# Altium project Gateway.PrjPcb
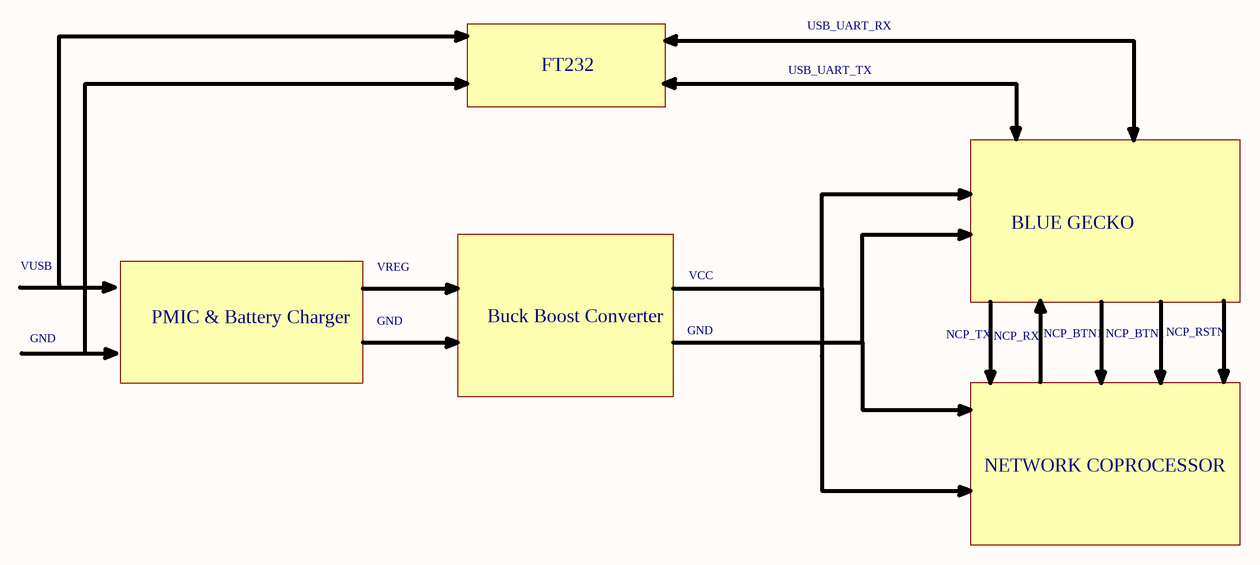
[diagram p0: BlockDiagram.SchDoc]
6 sheets, 93 parts. Net scope: global (net labels, ports and power ports of the same name join across sheets).
Board file: Gateway.PcbDoc
Sheets:
  BlockDiagram.SchDoc
  PMIC.SchDoc
  Regulator.SchDoc
  Gecko.SchDoc
  Gecko_IO.SchDoc
  UART_USB.SchDoc

## Sheet BlockDiagram.SchDoc: Block Diagram
size A4; Organization: Gateway; Address1: University of Colorado; Address2: Boulder; DocumentNumber: 1; Revision: 1; SheetNumber: 1; SheetTotal: 6

### Notes on the sheet
- USB_UART_RX
- FT232
- USB_UART_TX
- BLUE GECKO
- VUSB
- PMIC & Battery Charger
- VREG
- GND
- Buck Boost Converter
- VCC
- NCP_TX
- NCP_RX
- NCP_BTN1
- NCP_RSTN
- NETWORK COPROCESSOR
- Title
- Size:
- Date:
- A4
- Number:
- Time:
- Revision:
- Sheet
- of
- File:

## Sheet PMIC.SchDoc: PMIC
size A4; Organization: Gateway; Address1: University of Colorado; Address2: Boulder; DocumentNumber: 2; Revision: 1; SheetNumber: 2; SheetTotal: 6
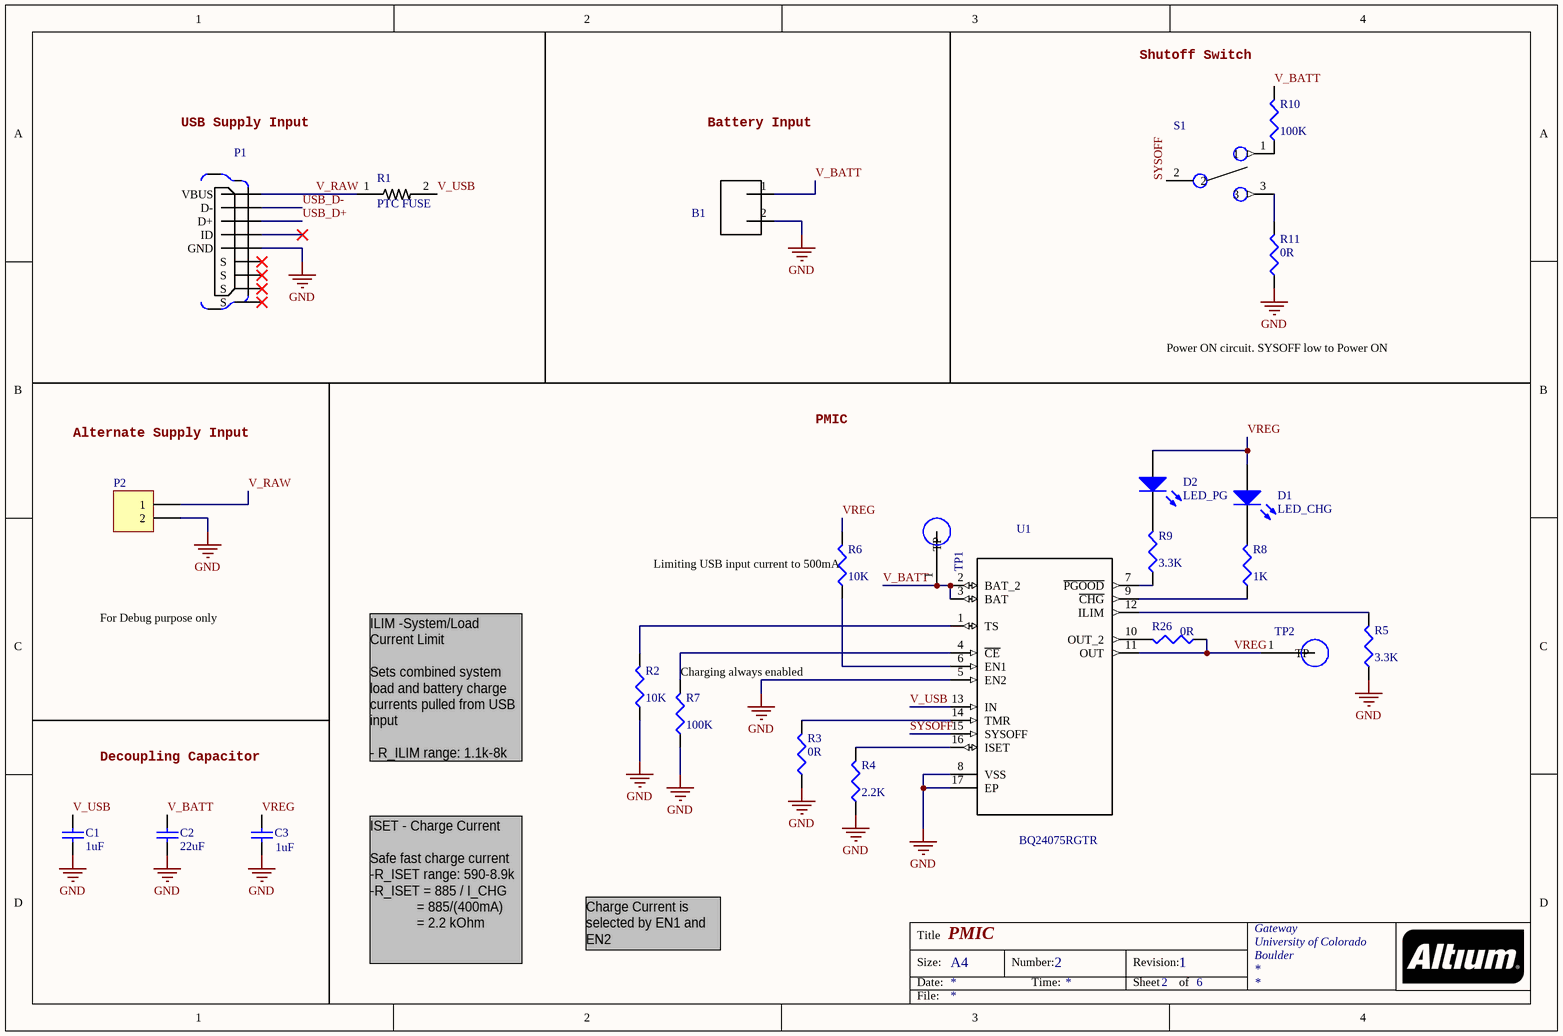
[diagram p1: PMIC.SchDoc]

### Parts
B1  VBATT  [S2B-PH-SM4-TB(LF)(SN)]  (value not drawn)
C1  value 1uF  [1608[0603]]  (hidden comment: CL10B105KP8NNNC)
C2  value 22uF  [1608[0603]]  (hidden comment: CL10A226MPCNUBE)
C3  value 1uF  [1608[0603]]  (hidden comment: CL10B105KP8NNNC)
D1  LED_CHG  [1608[0603]]
D2  LED_PG  [1608[0603]]
P1  10104111-0001LF  [FRAMATOME_10104111-0001LF]  (value not drawn)
P2  (no value)  [HDR1X2]
R1  PTC FUSE  [RESC3216X125N]
R2  value 10K  [1608[0603]]  (hidden comment: MCT06030C1002FP500)
R3  value 0R  [1608[0603]]  (hidden comment: MCT0603MZ0000ZP500)
R4  value 2.2K  [1608[0603]]  (hidden comment: ERJ-3EKF2201V)
R5  value 3.3K  [1608[0603]]  (hidden comment: ERJ-3GEYJ332V)
R6  value 10K  [1608[0603]]  (hidden comment: MCT06030C1002FP500)
R7  value 100K  [1608[0603]]  (hidden comment: RG1608P-104-B-T5)
R8  value 1K  [1608[0603]]  (hidden comment: MCT06030C1001FP500)
R9  value 3.3K  [1608[0603]]  (hidden comment: ERJ-3GEYJ332V)
R10  value 100K  [1608[0603]]  (hidden comment: RG1608P-104-B-T5)
R11  value 0R  [1608[0603]]  (hidden comment: MCT0603MZ0000ZP500)
R26  value 0R  [1608[0603]]  (hidden comment: MCT0603MZ0000ZP500)
S1  AYZ0102AGRLC  [SW_AYZ0102AGRLC]  (value not drawn)
TP1  VBATT_TP  [TP380X203]  (value not drawn)
TP2  VREG_TP  [TP380X203]  (value not drawn)
U1  BQ24075RGTR  [QFN50P300X300X100-17N]

### Nets
GND: B1.2 C1.1 C2.2 C3.1 P1.5(GND) P2.2 R2.1 R3.1 R4.1 R5.1 R7.1 R11.1 U1.5(EN2) U1.8(VSS) U1.17(EP)
SYSOFF: S1.2 U1.15(SYSOFF)
USB_D+: P1.3(D+)
USB_D-: P1.2(D-)
V_BATT: B1.1 C2.1 R10.2 TP1.1(TP) U1.2(BAT_2) U1.3(BAT)
V_RAW: P1.1(VBUS) P2.1 R1.1
V_USB: C1.2 R1.2 U1.13(IN)
VREG: C3.2 D1.1(A) D2.1(A) R6.2 R26.1 TP2.1(TP) U1.11(OUT)
NetD1_2: D1.2(K) R8.2
NetD2_2: D2.2(K) R9.2
NetR2_2: R2.2 U1.1(TS)
NetR3_2: R3.2 U1.14(TMR)
NetR4_2: R4.2 U1.16(ISET)
NetR5_2: R5.2 U1.12(ILIM)
NetR6_1: R6.1 U1.6(EN1)
NetR7_2: R7.2 U1.4(~{CE})
NetR8_1: R8.1 U1.9(~{CHG})
NetR9_1: R9.1 U1.7(~{PGOOD})
NetR10_1: R10.1 S1.1
NetR11_2: R11.2 S1.3
NetR26_2: R26.2 U1.10(OUT_2)

Not connected (* = marked no-connect by the designer): P1 4(ID)* 6(S)* 7(S)* 8(S)* 9(S)*

### Notes on the sheet
- Shutoff Switch
- USB Supply Input
- Battery Input
- Power ON circuit. SYSOFF low to Power ON
- Alternate Supply Input
- PMIC
- (near R6) Limiting USB input current to 500mA
- For Debug purpose only
- (near R7) Charging always enabled
- Decoupling Capacitor
- ILIM -System/Load Current Limit
  Sets combined system load and battery charge currents pulled from USB input
  - R_ILIM range: 1.1k-8k
  - R_ILIM= 1650 / I_INMAX
  = 1650 / 0.5
  = 3.3 kOhm
- ISET - Charge Current
  Safe fast charge current
  -R_ISET range: 590-8.9k
  -R_ISET = 885 / I_CHG
  = 885/(400mA)
  = 2.2 kOhm
- Charge Current is selected by EN1 and EN2
- Title
- Size:
- Date:
- A4
- Number:
- Time:
- Revision:
- Sheet
- of
- File:

### Library data of the parts
B1 = S2B-PH-SM4-TB(LF)(SN): CONN HEADER PH SIDE 2POS 2MM SMD; Manufacturer: JST Sales America Inc.; Digi-Key Part Number: 455-1749-1-ND; Manufacturer Part Number: S2B-PH-SM4-TB(LF)(SN); ComponentLink1URL: https://www.digikey.com/products/en/connectors-interconnects/rectangular-connectors-headers-male-pins/314?k=S2B-PH-SM4-TB%28LF%29%28SN%29&k=&pkeyword=S2B-PH-SM4-TB%28LF%29%28SN%29&pv7=2&sf=0&quantity=&ColumnSort=0&page=1&pageSize=25; ComponentLink1Description: Digi-Key URL
C1 C3 = Cap Semi: CAP CER 1UF 10V X7R 0603; Manufacturer: Samsung Electro-Mechanics; Digi-Key Part Number: 1276-1946-1-ND; Manufacturer Part Number: CL10B105KP8NNNC; ComponentLink1URL: https://www.digikey.com/product-detail/en/samsung-electro-mechanics/CL10B105KP8NNNC/1276-1946-1-ND/3890032; ComponentLink1Description: Digi-Key Link
C2 = Cap: CAP CER 22UF 10V X5R 0603; Manufacturer: Samsung Electro-Mechanics; Published: 8-Jun-2000; LatestRevisionDate: 17-Jul-2002; LatestRevisionNote: Re-released for DXP Platform.; PackageReference: RAD-0.3; Publisher: Altium Limited; PackageDescription: Radial Cap, Thru-Hole; 2 Leads; 0.3 in Pin Spacing; Manufacturer Part Number: CL10A226MPCNUBE; Digi-Key Part Number: 1276-6504-1-ND; ComponentLink1URL: https://www.digikey.com/product-detail/en/samsung-electro-mechanics/CL10A226MPCNUBE/1276-6504-1-ND/5961363; ComponentLink1Description: Digi-Key Link
D1 = LED2: Blue 470nm LED Indication - Discrete 2.85V 0603 (1608 Metric); Manufacturer: OSRAM Opto Semiconductors Inc.; Manufacturer Part Number: LB Q39G-L2OO-35-1; Digi-Key Part Number: 475-2816-1-ND; ComponentLink1URL: https://www.digikey.com/product-detail/en/osram-opto-semiconductors-inc/LB-Q39G-L2OO-35-1/475-2816-1-ND/2176355; ComponentLink1Description: Digi-Key Link
D2 = LED2: LED GREEN DIFFUSED 0603 SMD; Manufacturer: OSRAM Opto Semiconductors Inc.; Manufacturer Part Number: LG L29K-F2J1-24-Z; Digi-Key Part Number: 475-3118-1-ND; ComponentLink1URL: https://www.digikey.com/product-detail/en/osram-opto-semiconductors-inc/LG-L29K-F2J1-24-Z/475-3118-1-ND/4899549; ComponentLink1Description: Digi-Key Link
P1 = 10104111-0001LF: Micro Usb, 2.0 Type Ab, Receptacle, Th; Manufacturer: Amphenol FCI; Digi-Key Part Number: 609-4053-1-ND; ComponentLink1URL: https://www.digikey.com/product-detail/en/amphenol-fci/10104111-0001LF/609-4053-1-ND/2350359?utm_source=snapeda&utm_medium=aggregator&utm_campaign=symbol; Manufacturer Part Number: 10104111-0001LF; Value: *; ComponentLink1Description: Digi-Key Link
P2 = Header 2: Header, 2-Pin
R1 = 0ZCA0075FF2G: PTC RESET FUSE 6V 500MA 1206; Manufacturer: Bel Fuse; Manufacturer Part Number: Littelfuse Inc.; Package: 1206 Bel Fuse; Availability: Available; MP: 0ZCA0075FF2G; Price: None; SnapEDA_Link: https://www.snapeda.com/parts/0ZCA0075FF2G/Bel%20Fuse%20Inc./view-part/?ref=snap; Value: *; ComponentLink1URL: https://www.digikey.com/product-detail/en/littelfuse-inc/1206L050YR/F2112CT-ND/455721; ComponentLink1Description: Digi-Key Link; Digi-Key Part Number: F2112CT-ND
R2 R6 = Res3: RES SMD 10K OHM 1% 1/8W 0603; Manufacturer: Vishay Beyschlag; Digi-Key Part Number: MCT0603-10.0K-CFCT-ND; ComponentLink1URL: https://www.digikey.com/products/en?keywords=MCT0603-10.0K-CFCT-ND; ComponentLink1Description: Digi-Key URL; Manufacturer Part Number: MCT06030C1002FP500
R3 R11 R26 = Res3: RES 0 OHM JUMPER 1/8W 0603; Manufacturer: Vishay Beyschlag; Published: 8-Jun-2000; LatestRevisionDate: 29-May-2009; LatestRevisionNote: IPC-7351 Footprint Added.; PackageReference: J1-0603; Publisher: Altium Limited; PackageDescription: Chip Resistor; Digi-Key Part Number: 749-1745-1-ND; Manufacturer Part Number: MCT0603MZ0000ZP500; ComponentLink1URL: https://www.digikey.com/product-detail/en/vishay-beyschlag/MCT0603MZ0000ZP500/749-1745-1-ND/7348053
  R3 R26: ComponentLink1Description: Digi-Key Link
  R11: ComponentLink2Description: Digi-Key Link
R4 = Res3: RES SMD 2.2K OHM 1% 1/10W 0603; Manufacturer: Panasonic Electronic Components; Digi-Key Part Number: P2.20KHCT-ND; ComponentLink1URL: https://www.digikey.com/product-detail/en/panasonic-electronic-components/ERJ-3EKF2201V/P2.20KHCT-ND/1746742; ComponentLink1Description: Digi-Key URL; Manufacturer Part Number: ERJ-3EKF2201V
R5 R9 = Res3: RES SMD 3.3K OHM 5% 1/10W 0603; Manufacturer: Panasonic Electronic Components; Digi-Key Part Number: P3.3KGCT-ND; ComponentLink1URL: https://www.digikey.com/product-detail/en/panasonic-electronic-components/ERJ-3GEYJ332V/P3.3KGCT-ND/135146; ComponentLink1Description: Digi-Key URL; Manufacturer Part Number: ERJ-3GEYJ332V
R7 R10 = Res3: RES SMD 100K OHM 0.1% 1/10W 0603; Manufacturer: Susumu; Digi-Key Part Number: RG16P100KBCT-ND; ComponentLink1URL: https://www.digikey.com/products/en?keywords=RG16p100kbct-nd; ComponentLink1Description: Digi-Key URL; Manufacturer Part Number: RG1608P-104-B-T5
R8 = Res3: RES SMD 1K OHM 1% 1/8W 0603; Manufacturer: Vishay Beyschlag; Digi-Key Part Number: MCT0603-1.00K-CFCT-ND; ComponentLink1URL: https://www.digikey.com/product-detail/en/vishay-beyschlag/MCT06030C1001FP500/MCT0603-1.00K-CFCT-ND/2607875; ComponentLink1Description: Digi-Key URL; Manufacturer Part Number: MCT06030C1001FP500
S1 = AYZ0102AGRLC: SWITCH SLIDE SPDT 100MA 12V; Manufacturer: C&K; Digi-Key Part Number: 401-2012-1-ND; Manufacturer Part Number: AYZ0102AGRLC; ComponentLink1URL: https://www.digikey.com/products/en/switches/slide-switches/213?k=AYZ0102AGRLC&k=&pkeyword=AYZ0102AGRLC&pv7=2&sf=0&quantity=&ColumnSort=0&page=1&pageSize=25; ComponentLink1Description: Digi-Key Link
TP1 TP2 = 5019: PC TEST POINT MINIATURE; Manufacturer: Keystone Electronics; MF: Keystone; MP: 5019; Package: 2010 Keystone; Digi-Key_Part_Number: 36-5019CT-ND; ComponentLink1URL: https://www.digikey.com/product-detail/en/keystone-electronics/5019/36-5019CT-ND/3907344?utm_source=snapeda&utm_medium=aggregator&utm_campaign=symbol; SnapEDA_Link: https://www.snapeda.com/parts/5019/Keystone%20Electronics/view-part/?ref=snap; Value: *; ComponentLink1Description: Digi-Key Link; Manufacturer Part Number: 5019; Digi-Key Part Number: 36-5019CT-ND
U1 = BQ24075RGTT: IC LI-ION CHARGE MGMT 16-QFN; Manufacturer: Texas Instruments; SnapEDA_Link: https://www.snapeda.com/parts/BQ24075RGTT/Texas%20Instruments/view-part/?ref=snap; Manufacturer Part Number: BQ24075RGTT; Availability: Available; Package: QFN-16 Texas Instruments; Price: None; Value: *; Digi-Key Part Number: 296-38874-1-ND; ComponentLink1URL: https://www.digikey.com/product-detail/en/texas-instruments/BQ24075RGTR/296-38874-1-ND/5142986; ComponentLink1Description: Digi Key Link

## Sheet Regulator.SchDoc: Regulator
size A4; Organization: Gateway; Address1: University of Colorado; Address2: Boulder; DocumentNumber: 3; Revision: 1; SheetNumber: 3; SheetTotal: 6
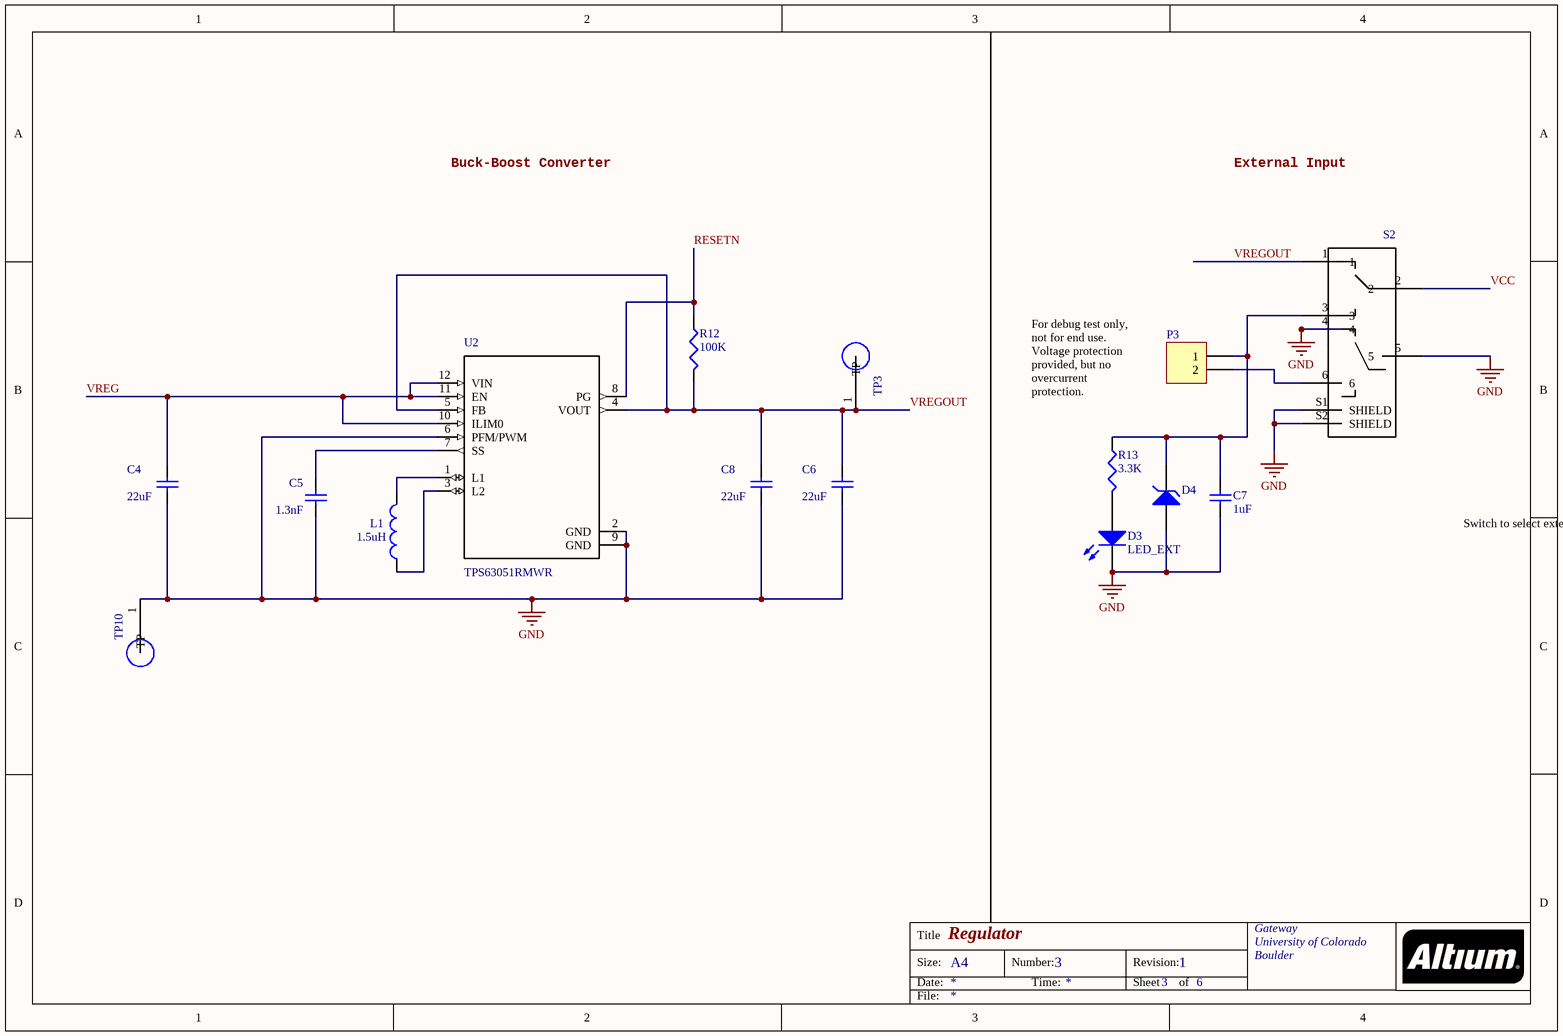
[diagram p2: Regulator.SchDoc]

### Parts
C4  value 22uF  [1608[0603]]  (hidden comment: CL10A226MPCNUBE)
C5  value 1.3nF  [1608[0603]]  (hidden comment: C0603C132J3GAC7867)
C6  value 22uF  [1608[0603]]  (hidden comment: CL10A226MPCNUBE)
C7  value 1uF  [1608[0603]]  (hidden comment: CL10B105KP8NNNC)
C8  value 22uF  [1608[0603]]  (hidden comment: CL10A226MPCNUBE)
D3  LED_EXT  [1608[0603]]
D4  CZRQR3V3B-HF  [0402]  (value not drawn)
L1  value 1.5uH  [1608[0603]]  (hidden comment: LQM18PN1R5MFHD)
P3  (no value)  [HDR1X2]
R12  value 100K  [1608[0603]]  (hidden comment: RG1608P-104-B-T5)
R13  value 3.3K  [1608[0603]]  (hidden comment: ERJ-3GEYJ332V)
S2  1825289-1  [SW_1825289-1_1825289-1(Primary)]  (value not drawn)
TP3  VREGOUT_TP  [TP380X203]  (value not drawn)
TP10  GND_TP  [TP380X203]  (value not drawn)
U2  TPS63051RMWR  [QFN50P250X250X100-12N]

### Nets
GND: C4.1 C5.1 C6.1 C7.1 C8.1 D3.2(K) D4.1(A) S2.4 S2.5 S2.S1(SHIELD) S2.S2(SHIELD) TP10.1(TP) U2.2(GND) U2.6(PFM/PWM) U2.9(GND)
RESETN: R12.1 U2.8(PG)
VCC: S2.2
VREG: C4.2 U2.10(ILIM0) U2.11(EN) U2.12(VIN)
VREGOUT: C6.2 C8.2 R12.2 S2.1 TP3.1(TP) U2.4(VOUT) U2.5(FB)
NetC5_2: C5.2 U2.7(SS)
NetC7_2: C7.2 D4.2(K) P3.1 R13.2 S2.3
NetD3_1: D3.1(A) R13.1
NetL1_1: L1.1 U2.3(L2)
NetL1_2: L1.2 U2.1(L1)
NetP3_2: P3.2 S2.6

### Notes on the sheet
- Buck-Boost Converter
- External Input
- For debug test only, not for end use. Voltage protection provided, but no overcurrent protection.
- (near C7) Switch to select external supply
- Title
- Size:
- Date:
- A4
- Number:
- Time:
- Revision:
- Sheet
- of
- File:

### Library data of the parts
C4 C6 C8 = Cap: as C2 on sheet PMIC; Published: 8-Jun-2000; LatestRevisionDate: 17-Jul-2002; LatestRevisionNote: Re-released for DXP Platform.; PackageReference: RAD-0.3; Publisher: Altium Limited; PackageDescription: Radial Cap, Thru-Hole; 2 Leads; 0.3 in Pin Spacing; ComponentLink1URL: https://www.digikey.com/product-detail/en/samsung-electro-mechanics/CL10A226MPCNUBE/1276-6504-1-ND/5961363; ComponentLink1Description: Digi-Key Link; Manufacturer Part Number: CL10A226MPCNUBE; Digi-Key Part Number: 1276-6504-1-ND
C5 = Cap: CAP CER 1300PF 25V C0G/NP0 0603; Manufacturer: KEMET; Published: 8-Jun-2000; LatestRevisionDate: 17-Jul-2002; LatestRevisionNote: Re-released for DXP Platform.; PackageReference: RAD-0.3; Publisher: Altium Limited; PackageDescription: Radial Cap, Thru-Hole; 2 Leads; 0.3 in Pin Spacing; ComponentLink1URL: https://www.digikey.com/product-detail/en/kemet/C0603C132J3GAC7867/399-14953-1-ND/7382502; ComponentLink1Description: Digi-Key Link; Manufacturer Part Number: C0603C132J3GAC7867; Digi-Key Part Number: 399-14953-1-ND
C7 = Cap Semi: as C1 on sheet PMIC; Digi-Key Part Number: 1276-1946-1-ND; Manufacturer Part Number: CL10B105KP8NNNC; ComponentLink1URL: https://www.digikey.com/product-detail/en/samsung-electro-mechanics/CL10B105KP8NNNC/1276-1946-1-ND/3890032; ComponentLink1Description: Digi-Key Link
D3 = LED2: as D2 on sheet PMIC; Digi-Key Part Number: 475-3118-1-ND; ComponentLink1URL: https://www.digikey.com/product-detail/en/osram-opto-semiconductors-inc/LG-L29K-F2J1-24-Z/475-3118-1-ND/4899549; ComponentLink1Description: Digi-Key Link
D4 = D Zener: DIODE ZENER 3.3V 125MW 0402; Manufacturer: Comchip Technology; ComponentLink1Description: Digi-Key Link; Value: *; Manufacturer Part Number: CZRQR3V3B-HF; Digi-Key Part Number: 641-1682-1-ND; ComponentLink1URL: https://www.digikey.com/product-detail/en/comchip-technology/CZRQR3V3B-HF/641-1682-1-ND/5147319
L1 = Inductor: FIXED IND 1.5UH 1.1A 213 MOHM; Manufacturer: Murata Electronics North America; Code_IEC: 1005; PackageReference: 0402-A; Published: 8-Jun-2000; LatestRevisionDate: 29-May-2009; LatestRevisionNote: IPC-7351 Footprint Added.; Publisher: Altium Limited; PackageDescription: Chip Inductor; Code_JEITA: 0402; Manufacturer Part Number: LQM18PN1R5MFHD; Digi-Key Part Number: 490-15637-1-ND; ComponentLink1URL: https://www.digikey.com/product-detail/en/murata-electronics-north-america/LQM18PN1R5MFHD/490-15637-1-ND/6800302; ComponentLink1Description: Digi-Key Link
P3 = Header 2: Header, 2-Pin; LatestRevisionDate: 17-Jul-2002; LatestRevisionNote: Re-released for DXP Platform.; Publisher: Altium Limited
R12 = Res3: as R7 on sheet PMIC; PackageReference: J1-0603; Published: 8-Jun-2000; LatestRevisionDate: 29-May-2009; LatestRevisionNote: IPC-7351 Footprint Added.; Publisher: Altium Limited; PackageDescription: Chip Resistor; Manufacturer Part Number: RG1608P-104-B-T5; Digi-Key Part Number: RG16P100KBCT-ND; ComponentLink1URL: https://www.digikey.com/products/en/resistors/chip-resistor-surface-mount/52?k=RG1608P-104-B-T5&k=&pkeyword=RG1608P-104-B-T5&pv7=2&sf=0&quantity=&ColumnSort=0&page=1&pageSize=25; ComponentLink1Description: Digi-Key Link
R13 = Res3: as R5 on sheet PMIC; Digi-Key Part Number: P3.3KGCT-ND; ComponentLink1URL: https://www.digikey.com/product-detail/en/panasonic-electronic-components/ERJ-3GEYJ332V/P3.3KGCT-ND/135146; ComponentLink1Description: Digi-Key URL; Manufacturer Part Number: ERJ-3GEYJ332V
S2 = 1825289-1: MHS22204=DPDT SL SW VERT AG; Manufacturer: TE Connectivity; Manufacturer Part Number: 1825289-1; ComponentLink1URL: https://www.digikey.com/products/en?keywords=MHS22204; ComponentLink1Description: Digi-Key Link; Digi-Key Part Number: 450-1572-ND
TP3 TP10 = 5019: as TP1 on sheet PMIC; MP: 5019; Package: 2010 Keystone; Digi-Key_Part_Number: 36-5019CT-ND; ComponentLink1URL: https://www.digikey.com/product-detail/en/keystone-electronics/5019/36-5019CT-ND/3907344?utm_source=snapeda&utm_medium=aggregator&utm_campaign=symbol; SnapEDA_Link: https://www.snapeda.com/parts/5019/Keystone%20Electronics/view-part/?ref=snap; Value: *; ComponentLink1Description: Digi-Key Link; Manufacturer Part Number: 5019; Digi-Key Part Number: 36-5019CT-ND
U2 = TPS63051RMWR: Tiny Single Inductor Buck Boost Converter 12-VQFN -40 to 85; Manufacturer: Texas Instruments; ComponentLink1Description: Digi-Key Link; ComponentLink1URL: https://www.digikey.com/products/en/integrated-circuits-ics/pmic-voltage-regulators-dc-dc-switching-regulators/739?k=TPS63051RMWR&k=&pkeyword=TPS63051RMWR&pv7=2&sf=0&quantity=&ColumnSort=0&page=1&pageSize=25; Digi-Key Part Number: 296-42650-1-ND; Manufacturer Part Number: TPS63051RMWR

## Sheet Gecko.SchDoc: Gecko
size A4; Organization: Gateway; Address1: University of Colorado; Address2: Boulder; DocumentNumber: 4; Revision: 1; SheetNumber: 4; SheetTotal: 6
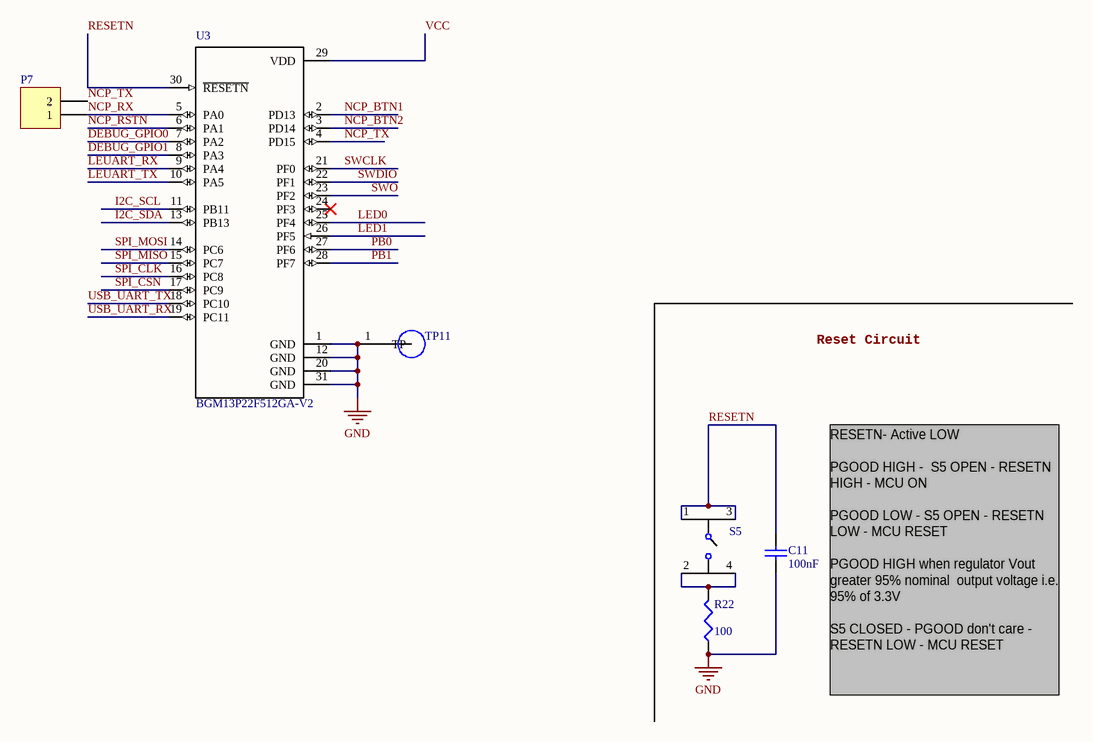
[diagram p3: Gecko.SchDoc]

### Parts
C11  value 100nF  [1608[0603]]  (hidden comment: CL10F104ZO8NNNC)
P7  Header 2  [HDR1X2]  (value not drawn)
R22  value 100  [1608[0603]]  (hidden comment: CRCW0603100RJNEAC)
S5  430182043816  [430182043816]  (value not drawn)
TP11  5019  [TP380X203]  (value not drawn)
U3  BGM13P22F512GA-V2  [MODULE_BGM13P22F512GA-V2]

### Nets
GND: C11.2 R22.1 TP11.1(TP) U3.1(GND) U3.12(GND) U3.20(GND) U3.31(GND)
DEBUG_GPIO0: U3.7(PA2)
DEBUG_GPIO1: U3.8(PA3)
I2C_SCL: U3.11(PB11)
I2C_SDA: U3.13(PB13)
LED0: U3.25(PF4)
LED1: U3.26(PF5)
LEUART_RX: U3.9(PA4)
LEUART_TX: U3.10(PA5)
NCP_BTN1: U3.2(PD13)
NCP_BTN2: U3.3(PD14)
NCP_RSTN: U3.6(PA1)
NCP_RX: P7.1 U3.5(PA0)
NCP_TX: P7.2 U3.4(PD15)
PB0: U3.27(PF6)
PB1: U3.28(PF7)
RESETN: C11.1 S5.1 S5.3 U3.30(~{RESETN})
SPI_CLK: U3.16(PC8)
SPI_CSN: U3.17(PC9)
SPI_MISO: U3.15(PC7)
SPI_MOSI: U3.14(PC6)
SWCLK: U3.21(PF0)
SWDIO: U3.22(PF1)
SWO: U3.23(PF2)
USB_UART_RX: U3.19(PC11)
USB_UART_TX: U3.18(PC10)
VCC: U3.29(VDD)
NetR22_2: R22.2 S5.2 S5.4

Not connected (* = marked no-connect by the designer): U3 24(PF3)*

### Notes on the sheet
- Reset Circuit
- RESETN- Active LOW
  PGOOD HIGH -  S5 OPEN - RESETN HIGH - MCU ON
  PGOOD LOW - S5 OPEN - RESETN LOW - MCU RESET
  PGOOD HIGH when regulator Vout greater 95% nominal  output voltage i.e. 95% of 3.3V
  S5 CLOSED - PGOOD don't care - RESETN LOW - MCU RESET
- Title
- Size:
- Date:
- A4
- Number:
- Time:
- Revision:
- Sheet
- of
- File:

### Library data of the parts
C11 = Cap: CAP CER 0.1UF 16V X7R 0603; Manufacturer: Samsung Electro-Mechanics; Published: 8-Jun-2000; LatestRevisionDate: 17-Jul-2002; LatestRevisionNote: Re-released for DXP Platform.; PackageReference: RAD-0.3; Publisher: Altium Limited; PackageDescription: Radial Cap, Thru-Hole; 2 Leads; 0.3 in Pin Spacing; Digi-Key Part Number: 1276-1258-1-ND; Manufacturer Part Number: CL10F104ZO8NNNC; ComponentLink1Description: Digi-Key Link; ComponentLink1URL: https://www.digikey.com/product-detail/en/samsung-electro-mechanics/CL10F104ZO8NNNC/1276-1258-1-ND/3889344
P7 = Header 2: Header, 2-Pin; LatestRevisionDate: 17-Jul-2002; LatestRevisionNote: Re-released for DXP Platform.; Publisher: Altium Limited
R22 = Res3: RES SMD 100 OHM 5% 1/10W 0603; Manufacturer: Vishay Dale; Published: 8-Jun-2000; LatestRevisionDate: 29-May-2009; LatestRevisionNote: IPC-7351 Footprint Added.; PackageReference: J1-0603; Publisher: Altium Limited; PackageDescription: Chip Resistor; Digi-Key Part Number: 541-4059-1-ND; Manufacturer Part Number: CRCW0603100RJNEAC; ComponentLink1URL: https://www.digikey.com/product-detail/en/vishay-dale/CRCW0603100RJNEAC/541-4059-1-ND/7928742; ComponentLink1Description: Digi-Key Link
S5 = 430182043816: SWITCH TACTILE SPST-NO 0.05A 12V; Manufacturer: Wurth Electronics; Manufacturer Part Number: 430182043816; Value: *; Digi-Key Part Number: 732-7004-1-ND; ComponentLink1URL: https://www.digikey.com/products/en/switches/tactile-switches/197?k=430+182+043+816&k=&pkeyword=430+182+043+816&pv7=2&sf=0&quantity=&ColumnSort=0&page=1&pageSize=25; ComponentLink1Description: Digi-Key Link
TP11 = 5019: as TP1 on sheet PMIC; MP: 5019; Package: 2010 Keystone; Digi-Key_Part_Number: 36-5019CT-ND; Digi-Key_Purchase_URL: https://www.digikey.com/product-detail/en/keystone-electronics/5019/36-5019CT-ND/3907344?utm_source=snapeda&utm_medium=aggregator&utm_campaign=symbol; SnapEDA_Link: https://www.snapeda.com/parts/5019/Keystone%20Electronics/view-part/?ref=snap; Value: *; ComponentLink1Description: Digi-Key Link; ComponentLink1URL: https://www.digikey.com/product-detail/en/keystone-electronics/5019/36-5019CT-ND/3907344?utm_source=snapeda&utm_medium=aggregator&utm_campaign=symbol; Digi-Key Part Number: 36-5019CT-ND; Manufacturer Part Number: 5019
U3 = BGM13P22F512GA-V2: EFR32BG13 Bluetooth 5.0 Module, 512kB Flash, +8dbm; Manufacturer: Silicon Labs; Price: None; Package: Module Silicon Labs; SnapEDA_Link: https://www.snapeda.com/parts/BGM13P22F512GA-V2/Silicon%20Labs/view-part/?ref=snap; Availability: Available; Manufacturer Part Number: BGM13P22F512GA-V2; Value: *; Digi-Key Part Number: 336-5465-1-ND; ComponentLink1URL: https://www.digikey.com/product-detail/en/silicon-labs/BGM13P32F512GA-V2R/336-5465-1-ND/9324917; ComponentLink1Description: Digi-Key Link

## Sheet Gecko_IO.SchDoc: Gecko_IO
size A4; Organization: Gateway; Address1: University of Colorado; Address2: Boulder; DocumentNumber: 5; Revision: 1; SheetNumber: 5; SheetTotal: 6
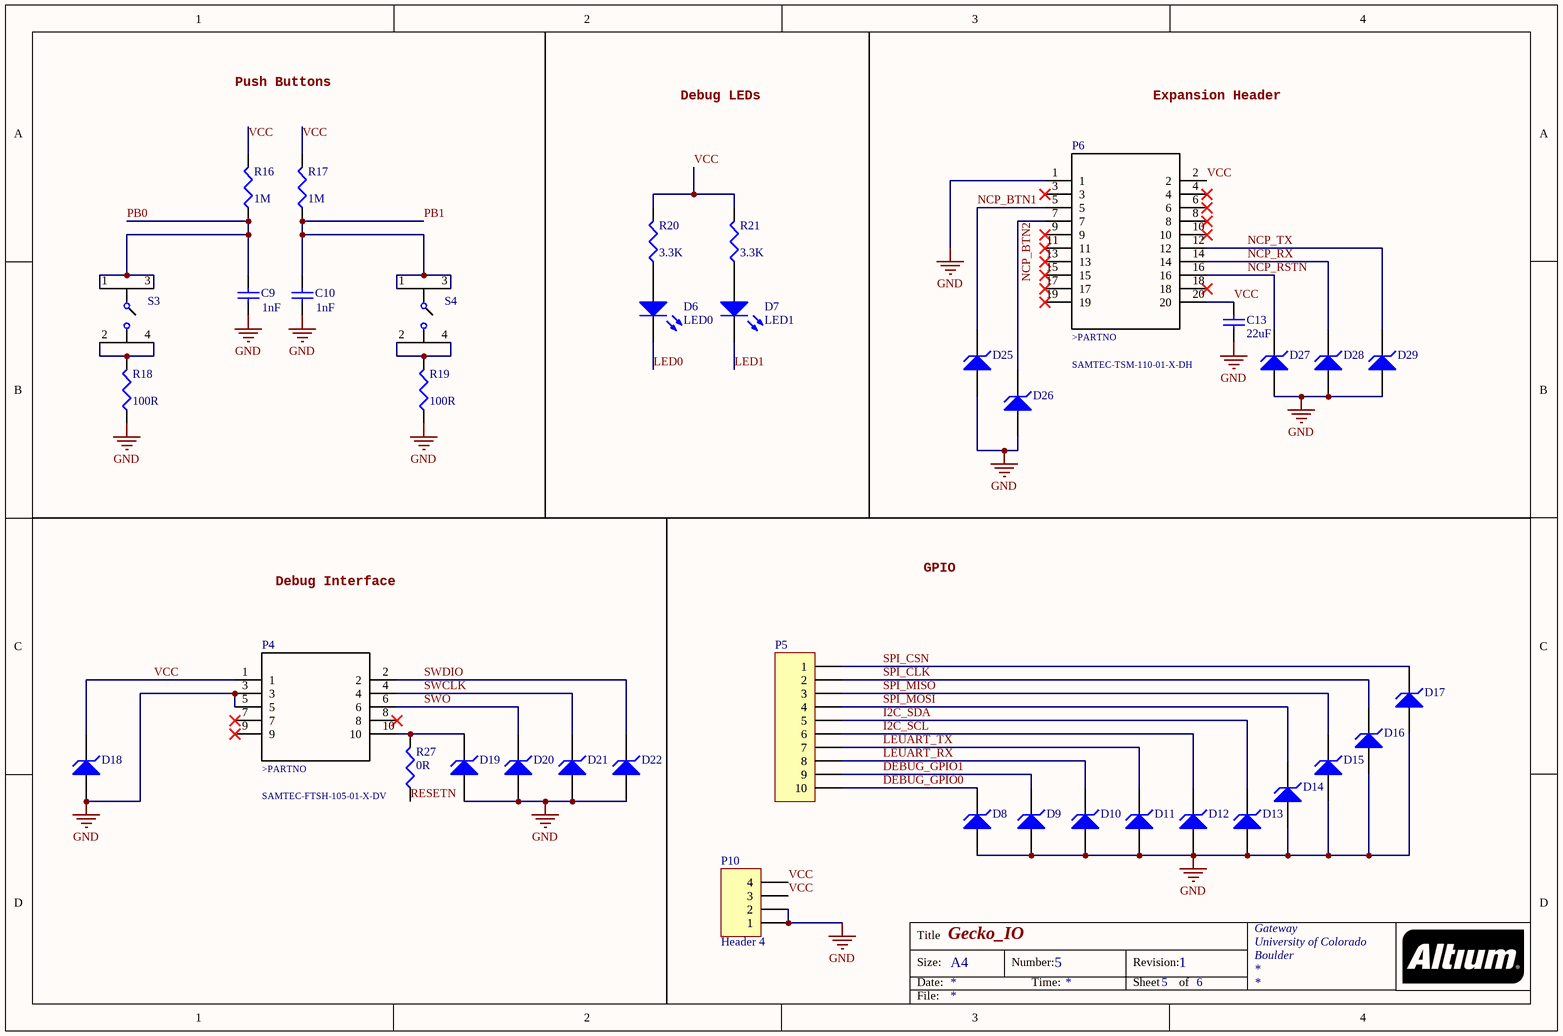
[diagram p4: Gecko_IO.SchDoc]

### Parts
C9  value 1nF  [1608[0603]]  (hidden comment: 06035C102JAT2A)
C10  value 1nF  [1608[0603]]  (hidden comment: 06035C102JAT2A)
C13  value 22uF  [1608[0603]]  (hidden comment: CL10A226MPCNUBE)
D6  LED0  [1608[0603]]
D7  LED1  [1608[0603]]
D8  CZRQR3V3B-HF  [0402]  (value not drawn)
D9  CZRQR3V3B-HF  [0402]  (value not drawn)
D10  CZRQR3V3B-HF  [0402]  (value not drawn)
D11  CZRQR3V3B-HF  [0402]  (value not drawn)
D12  CZRQR3V3B-HF  [0402]  (value not drawn)
D13  CZRQR3V3B-HF  [0402]  (value not drawn)
D14  CZRQR3V3B-HF  [0402]  (value not drawn)
D15  CZRQR3V3B-HF  [0402]  (value not drawn)
D16  CZRQR3V3B-HF  [0402]  (value not drawn)
D17  CZRQR3V3B-HF  [0402]  (value not drawn)
D18  CZRQR3V3B-HF  [0402]  (value not drawn)
D19  CZRQR3V3B-HF  [0402]  (value not drawn)
D20  CZRQR3V3B-HF  [0402]  (value not drawn)
D21  CZRQR3V3B-HF  [0402]  (value not drawn)
D22  CZRQR3V3B-HF  [0402]  (value not drawn)
D25  CZRQR3V3B-HF  [0402]  (value not drawn)
D26  CZRQR3V3B-HF  [0402]  (value not drawn)
D27  CZRQR3V3B-HF  [0402]  (value not drawn)
D28  CZRQR3V3B-HF  [0402]  (value not drawn)
D29  CZRQR3V3B-HF  [0402]  (value not drawn)
P4  PROG_HDR  [SAMTEC-FTSH-105-01-X-DV]  (value not drawn)
P5  (no value)  [HDR1X10]
P6  TSM-110-01-L-DH-A-P-TR  [SAMTEC-TSM-110-01-X-DH]  (value not drawn)
P10  Header 4  [HDR1X4]
R16  value 1M  [1608[0603]]  (hidden comment: RC1608J105CS)
R17  value 1M  [1608[0603]]  (hidden comment: RC1608J105CS)
R18  value 100R  [1608[0603]]  (hidden comment: CRCW0603100RJNEAC)
R19  value 100R  [1608[0603]]  (hidden comment: CRCW0603100RJNEAC)
R20  value 3.3K  [1608[0603]]  (hidden comment: ERJ-3GEYJ332V)
R21  value 3.3K  [1608[0603]]  (hidden comment: ERJ-3GEYJ332V)
R27  value 0R  [C1206]  (hidden comment: MCT0603MZ0000ZP500)
S3  PB0  [430182043816]  (value not drawn)
S4  PB1  [430182043816]  (value not drawn)

### Nets
GND: C9.1 C10.1 C13.2 D8.1(A) D9.1(A) D10.1(A) D11.1(A) D12.1(A) D13.1(A) D14.1(A) D15.1(A) D16.1(A) D17.1(A) D18.1(A) D19.1(A) D20.1(A) D21.1(A) D22.1(A) D25.1(A) D26.1(A) D27.1(A) D28.1(A) D29.1(A) P4.3 P4.5 P6.1 P10.1 P10.2 R18.1 R19.1
DEBUG_GPIO0: D8.2(K) P5.10
DEBUG_GPIO1: D9.2(K) P5.9
I2C_SCL: D12.2(K) P5.6
I2C_SDA: D13.2(K) P5.5
LED0: D6.2(K)
LED1: D7.2(K)
LEUART_RX: D10.2(K) P5.8
LEUART_TX: D11.2(K) P5.7
NCP_BTN1: D25.2(K) P6.5
NCP_BTN2: D26.2(K) P6.7
NCP_RSTN: D27.2(K) P6.16
NCP_RX: D28.2(K) P6.14
NCP_TX: D29.2(K) P6.12
PB0: C9.2 R16.1 S3.1 S3.3
PB1: C10.2 R17.1 S4.1 S4.3
RESETN: R27.1
SPI_CLK: D16.2(K) P5.2
SPI_CSN: D17.2(K) P5.1
SPI_MISO: D15.2(K) P5.3
SPI_MOSI: D14.2(K) P5.4
SWCLK: D21.2(K) P4.4
SWDIO: D22.2(K) P4.2
SWO: D20.2(K) P4.6
VCC: C13.1 D18.2(K) P4.1 P6.2 P6.20 P10.3 P10.4 R16.2 R17.2 R20.2 R21.2
NetD6_1: D6.1(A) R20.1
NetD7_1: D7.1(A) R21.1
NetD19_2: D19.2(K) P4.10 R27.2
NetR18_2: R18.2 S3.2 S3.4
NetR19_2: R19.2 S4.2 S4.4

Not connected (* = marked no-connect by the designer): P4 7* 8* 9*; P6 3* 4* 6* 8* 9* 10* 11* 13* 15* 17* 18* 19*

### Notes on the sheet
- Push Buttons
- Debug LEDs
- Expansion Header
- Debug Interface
- GPIO
- Title
- Size:
- Date:
- A4
- Number:
- Time:
- Revision:
- Sheet
- of
- File:
- (in symbol SAMTEC-FTSH-105-01-X-DV) >PARTNO
- (in symbol SAMTEC-TSM-110-01-X-DH) >PARTNO

### Library data of the parts
C9 C10 = Cap: CAP CER 1000PF 50V X7R 0603; Manufacturer: AVX Corporation; Published: 8-Jun-2000; LatestRevisionDate: 17-Jul-2002; LatestRevisionNote: Re-released for DXP Platform.; PackageReference: RAD-0.3; Publisher: Altium Limited; PackageDescription: Radial Cap, Thru-Hole; 2 Leads; 0.3 in Pin Spacing; Digi-Key Part Number: 478-5006-1-ND; Manufacturer Part Number: 06035C102JAT2A; ComponentLink1Description: Digi-Key Link; ComponentLink1URL: https://www.digikey.com/product-detail/en/avx-corporation/06035C102JAT2A/478-5006-1-ND/1888217
C13 = Cap: as C2 on sheet PMIC; Published: 8-Jun-2000; LatestRevisionDate: 17-Jul-2002; LatestRevisionNote: Re-released for DXP Platform.; PackageReference: RAD-0.3; Publisher: Altium Limited; PackageDescription: Radial Cap, Thru-Hole; 2 Leads; 0.3 in Pin Spacing; Manufacturer Part Number: CL10A226MPCNUBE; Digi-Key Part Number: 1276-6504-1-ND; ComponentLink1URL: https://www.digikey.com/product-detail/en/samsung-electro-mechanics/CL10A226MPCNUBE/1276-6504-1-ND/5961363; ComponentLink1Description: Digi-Key Link
D6 D7 = LED2: as D2 on sheet PMIC; Digi-Key Part Number: 475-3118-1-ND; ComponentLink1URL: https://www.digikey.com/product-detail/en/osram-opto-semiconductors-inc/LG-L29K-F2J1-24-Z/475-3118-1-ND/4899549; ComponentLink1Description: Digi-Key Link
D8-D22 D25-D29 = D Zener: as D4 on sheet Regulator; ComponentLink1Description: Digi-Key Link; Value: *; Manufacturer Part Number: CZRQR3V3B-HF; Digi-Key Part Number: 641-1682-1-ND; ComponentLink1URL: https://www.digikey.com/product-detail/en/comchip-technology/CZRQR3V3B-HF/641-1682-1-ND/5147319
P4 = SAMTEC-FTSH-105-01-X-DV: .050" X .050 TERMINAL STRIP; Manufacturer: Samtec; Manufacturer Part Number: FTSH-105-01-F-DV-K-TR; Value: *; Digi-Key Part Number: SAM13160CT-ND; ComponentLink1URL: https://www.digikey.com/products/en/connectors-interconnects/rectangular-connectors-headers-male-pins/314?k=FTSH-105-01-F-DV-K-TR&k=&pkeyword=FTSH-105-01-F-DV-K-TR&pv7=2&sf=0&quantity=&ColumnSort=0&page=1&pageSize=25; ComponentLink1Description: Digi-Key Link
P5 = Header 10: Header, 10-Pin; LatestRevisionDate: 17-Jul-2002; LatestRevisionNote: Re-released for DXP Platform.; Publisher: Altium Limited
P6 = SAMTEC-TSM-110-01-X-DH: .025 SQ. TERMINAL STRIPS; Manufacturer: Samtec Inc.; Digi-Key Part Number: SAM14883CT-ND; Manufacturer Part Number: TSM-110-01-L-DH-A-P-TR; ComponentLink1URL: https://www.digikey.com/product-detail/en/samtec-inc/TSM-110-01-L-DH-A-P-TR/SAM14883CT-ND/9595175; ComponentLink1Description: Digi-Key Link
P10 = Header 4: Header, 4-Pin; LatestRevisionDate: 17-Jul-2002; LatestRevisionNote: Re-released for DXP Platform.; Publisher: Altium Limited
R16 R17 = Res3: RES SMD 1M OHM 5% 1/10W 0603; Manufacturer: Samsung Electro-Mechanics; Published: 8-Jun-2000; LatestRevisionDate: 29-May-2009; LatestRevisionNote: IPC-7351 Footprint Added.; PackageReference: J1-0603; Publisher: Altium Limited; PackageDescription: Chip Resistor; Digi-Key Part Number: 1276-5134-1-ND; Manufacturer Part Number: RC1608J105CS; ComponentLink1URL: https://www.digikey.com/product-detail/en/samsung-electro-mechanics/RC1608J105CS/1276-5134-1-ND/3968106; ComponentLink1Description: Digi-Key Link
R18 R19 = Res3: as R22 on sheet Gecko; Published: 8-Jun-2000; LatestRevisionDate: 29-May-2009; LatestRevisionNote: IPC-7351 Footprint Added.; PackageReference: J1-0603; Publisher: Altium Limited; PackageDescription: Chip Resistor; Digi-Key Part Number: 541-4059-1-ND; Manufacturer Part Number: CRCW0603100RJNEAC; ComponentLink1URL: https://www.digikey.com/product-detail/en/vishay-dale/CRCW0603100RJNEAC/541-4059-1-ND/7928742; ComponentLink1Description: Digi-Key Link
R20 R21 = Res3: as R5 on sheet PMIC; Digi-Key Part Number: P3.3KGCT-ND; ComponentLink1URL: https://www.digikey.com/product-detail/en/panasonic-electronic-components/ERJ-3GEYJ332V/P3.3KGCT-ND/135146; ComponentLink1Description: Digi-Key URL; Manufacturer Part Number: ERJ-3GEYJ332V
R27 = Res3: as R3 on sheet PMIC; Published: 8-Jun-2000; LatestRevisionDate: 29-May-2009; LatestRevisionNote: IPC-7351 Footprint Added.; PackageReference: J1-0603; Publisher: Altium Limited; PackageDescription: Chip Resistor; Digi-Key Part Number: 749-1745-1-ND; Manufacturer Part Number: MCT0603MZ0000ZP500; ComponentLink1URL: https://www.digikey.com/product-detail/en/vishay-beyschlag/MCT0603MZ0000ZP500/749-1745-1-ND/7348053; ComponentLink1Description: Digi-Key Link
S3 S4 = 430182043816: as S5 on sheet Gecko; Manufacturer Part Number: 430182043816; Value: *; Digi-Key Part Number: 732-7004-1-ND; ComponentLink1URL: https://www.digikey.com/products/en/switches/tactile-switches/197?k=430+182+043+816&k=&pkeyword=430+182+043+816&pv7=2&sf=0&quantity=&ColumnSort=0&page=1&pageSize=25; ComponentLink1Description: Digi-Key Link

## Sheet UART_USB.SchDoc: UART to USB FT232
size A4; Organization: Gateway; Address1: University of Colorado; Address2: Boulder; DocumentNumber: 6; Revision: 1; SheetNumber: 6; SheetTotal: 6; Rule: PcbType=ProtelPcb
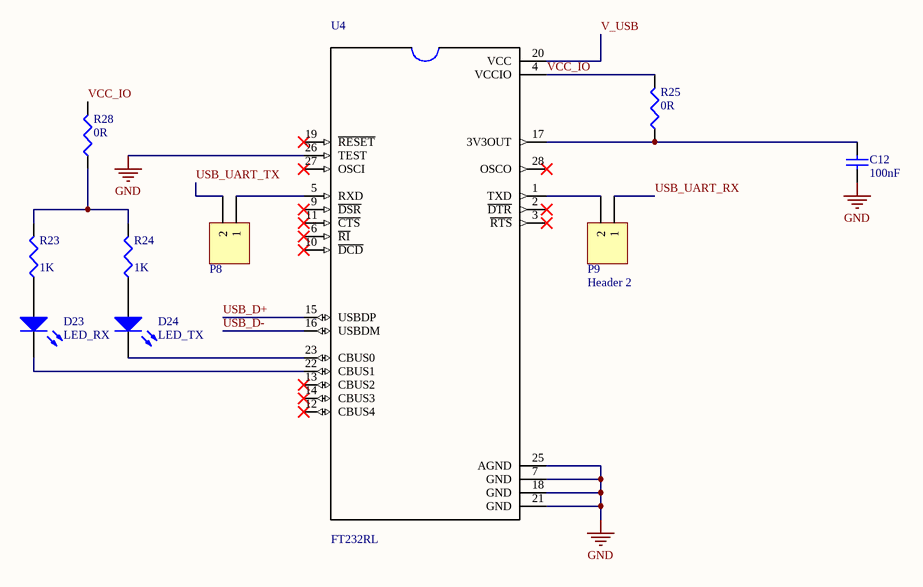
[diagram p5: UART_USB.SchDoc]

### Parts
C12  value 100nF  [1608[0603]]  (hidden comment: CL10F104ZO8NNNC)
D23  LED_RX  [1608[0603]]
D24  LED_TX  [1608[0603]]
P8  Header 2  [HDR1X2]  (value not drawn)
P9  Header 2  [HDR1X2]
R23  value 1K  [1608[0603]]  (hidden comment: MCT06030C1001FP500)
R24  value 1K  [1608[0603]]  (hidden comment: MCT06030C1001FP500)
R25  value 0R  [C1206]  (hidden comment: MCT0603MZ0000ZP500)
R28  value 0R  [C1206]  (hidden comment: MCT0603MZ0000ZP500)
U4  FT232RL  [SOP65P780X200-28N]

### Nets
GND: C12.2 U4.7(GND) U4.18(GND) U4.21(GND) U4.25(AGND) U4.26(TEST)
USB_D+: U4.15(USBDP)
USB_D-: U4.16(USBDM)
USB_UART_RX: P9.1
USB_UART_TX: P8.2
V_USB: U4.20(VCC)
VCC_IO: R25.2 R28.2 U4.4(VCCIO)
NetC12_1: C12.1 R25.1 U4.17(3V3OUT)
NetD23_1: D23.1(A) R23.1
NetD23_2: D23.2(K) U4.22(CBUS1)
NetD24_1: D24.1(A) R24.1
NetD24_2: D24.2(K) U4.23(CBUS0)
NetP8_1: P8.1 U4.5(RXD)
NetP9_2: P9.2 U4.1(TXD)
NetR23_2: R23.2 R24.2 R28.1

Not connected (* = marked no-connect by the designer): U4 2(~{DTR})* 3(~{RTS})* 6(~{RI})* 9(~{DSR})* 10(~{DCD})* 11(~{CTS})* 12(CBUS4)* 13(CBUS2)* 14(CBUS3)* 19(~{RESET})* 27(OSCI)* 28(OSCO)*

### Notes on the sheet
- Title
- Size:
- Date:
- A4
- Number:
- Time:
- Revision:
- Sheet
- of
- File:

### Library data of the parts
C12 = Cap: as C11 on sheet Gecko; Published: 8-Jun-2000; LatestRevisionDate: 17-Jul-2002; LatestRevisionNote: Re-released for DXP Platform.; PackageReference: RAD-0.3; Publisher: Altium Limited; PackageDescription: Radial Cap, Thru-Hole; 2 Leads; 0.3 in Pin Spacing; Digi-Key Part Number: 1276-1258-1-ND; Manufacturer Part Number: CL10F104ZO8NNNC; ComponentLink1Description: Digi-Key Link; ComponentLink1URL: https://www.digikey.com/product-detail/en/samsung-electro-mechanics/CL10F104ZO8NNNC/1276-1258-1-ND/3889344
D23 = LED2: LED RED DIFFUSED 0603 SMD; Manufacturer: OSRAM Opto Semiconductors Inc.; Manufacturer Part Number: LS L29K-H1J2-1-Z; Digi-Key Part Number: 475-1195-1-ND; ComponentLink1URL: https://www.digikey.com/product-detail/en/osram-opto-semiconductors-inc/LG-L29K-F2J1-24-Z/475-3118-1-ND/4899549; ComponentLink1Description: Digi-Key Link
D24 = LED2: LED YELLOW DIFFUSED 0603 SMD; Manufacturer: OSRAM Opto Semiconductors Inc.; Manufacturer Part Number: LY L29K-H1K2-26-Z; Digi-Key Part Number: 475-1196-1-ND; ComponentLink1URL: https://www.digikey.com/product-detail/en/osram-opto-semiconductors-inc/LY-L29K-H1K2-26-Z/475-1196-1-ND/810357; ComponentLink1Description: Digi-Key Link
P8 P9 = Header 2: Header, 2-Pin; LatestRevisionDate: 17-Jul-2002; LatestRevisionNote: Re-released for DXP Platform.; Publisher: Altium Limited
R23 R24 = Res3: as R8 on sheet PMIC; Digi-Key Part Number: MCT0603-1.00K-CFCT-ND; ComponentLink1URL: https://www.digikey.com/product-detail/en/vishay-beyschlag/MCT06030C1001FP500/MCT0603-1.00K-CFCT-ND/2607875; ComponentLink1Description: Digi-Key URL; Manufacturer Part Number: MCT06030C1001FP500
R25 R28 = Res3: as R3 on sheet PMIC; Digi-Key Part Number: 749-1745-1-ND; Manufacturer Part Number: MCT0603MZ0000ZP500; ComponentLink1URL: https://www.digikey.com/product-detail/en/vishay-beyschlag/MCT0603MZ0000ZP500/749-1745-1-ND/7348053; ComponentLink1Description: Digi-Key Link
U4 = FT232RL-REEL: USB Bridge, USB to UART USB 2.0 UART Interface 28-SSOP; Manufacturer: FTDI, Future Technology Devices International Ltd; MF: FTDI,; Package: SSOP-28 FTDI; MP: FT232RL-REEL; Price: None; SnapEDA_Link: https://www.snapeda.com/parts/FT232RL-REEL/FTDI%2C%20Future%20Technology%20Devices%20International%20Ltd/view-part/?ref=snap; Availability: Available; Value: *; ComponentLink1URL: https://www.digikey.com/product-detail/en/ftdi-future-technology-devices-international-ltd/FT232RL-REEL/768-1007-1-ND/1836402; Digi-Key Part Number: 768-1007-1-ND; ComponentLink1Description: Digi-Key Link; Manufacturer Part Number: FT232RL-REEL

## Nets that join several sheets
GND: PMIC (15 pins), Regulator (15 pins), Gecko (7 pins), Gecko_IO (30 pins), UART_USB (6 pins)
DEBUG_GPIO0: Gecko (U3.7), Gecko_IO (D8.2 P5.10)
DEBUG_GPIO1: Gecko (U3.8), Gecko_IO (D9.2 P5.9)
I2C_SCL: Gecko (U3.11), Gecko_IO (D12.2 P5.6)
I2C_SDA: Gecko (U3.13), Gecko_IO (D13.2 P5.5)
LED0: Gecko (U3.25), Gecko_IO (D6.2)
LED1: Gecko (U3.26), Gecko_IO (D7.2)
LEUART_RX: Gecko (U3.9), Gecko_IO (D10.2 P5.8)
LEUART_TX: Gecko (U3.10), Gecko_IO (D11.2 P5.7)
NCP_BTN1: Gecko (U3.2), Gecko_IO (D25.2 P6.5)
NCP_BTN2: Gecko (U3.3), Gecko_IO (D26.2 P6.7)
NCP_RSTN: Gecko (U3.6), Gecko_IO (D27.2 P6.16)
NCP_RX: Gecko (P7.1 U3.5), Gecko_IO (D28.2 P6.14)
NCP_TX: Gecko (P7.2 U3.4), Gecko_IO (D29.2 P6.12)
PB0: Gecko (U3.27), Gecko_IO (C9.2 R16.1 S3.1 S3.3)
PB1: Gecko (U3.28), Gecko_IO (C10.2 R17.1 S4.1 S4.3)
RESETN: Regulator (R12.1 U2.8), Gecko (C11.1 S5.1 S5.3 U3.30), Gecko_IO (R27.1)
SPI_CLK: Gecko (U3.16), Gecko_IO (D16.2 P5.2)
SPI_CSN: Gecko (U3.17), Gecko_IO (D17.2 P5.1)
SPI_MISO: Gecko (U3.15), Gecko_IO (D15.2 P5.3)
SPI_MOSI: Gecko (U3.14), Gecko_IO (D14.2 P5.4)
SWCLK: Gecko (U3.21), Gecko_IO (D21.2 P4.4)
SWDIO: Gecko (U3.22), Gecko_IO (D22.2 P4.2)
SWO: Gecko (U3.23), Gecko_IO (D20.2 P4.6)
USB_D+: PMIC (P1.3), UART_USB (U4.15)
USB_D-: PMIC (P1.2), UART_USB (U4.16)
USB_UART_RX: Gecko (U3.19), UART_USB (P9.1)
USB_UART_TX: Gecko (U3.18), UART_USB (P8.2)
V_USB: PMIC (C1.2 R1.2 U1.13), UART_USB (U4.20)
VCC: Regulator (S2.2), Gecko (U3.29), Gecko_IO (11 pins)
VREG: PMIC (7 pins), Regulator (C4.2 U2.10 U2.11 U2.12)